# EAGLE design CellarControl (EAGLE 7.2.0)
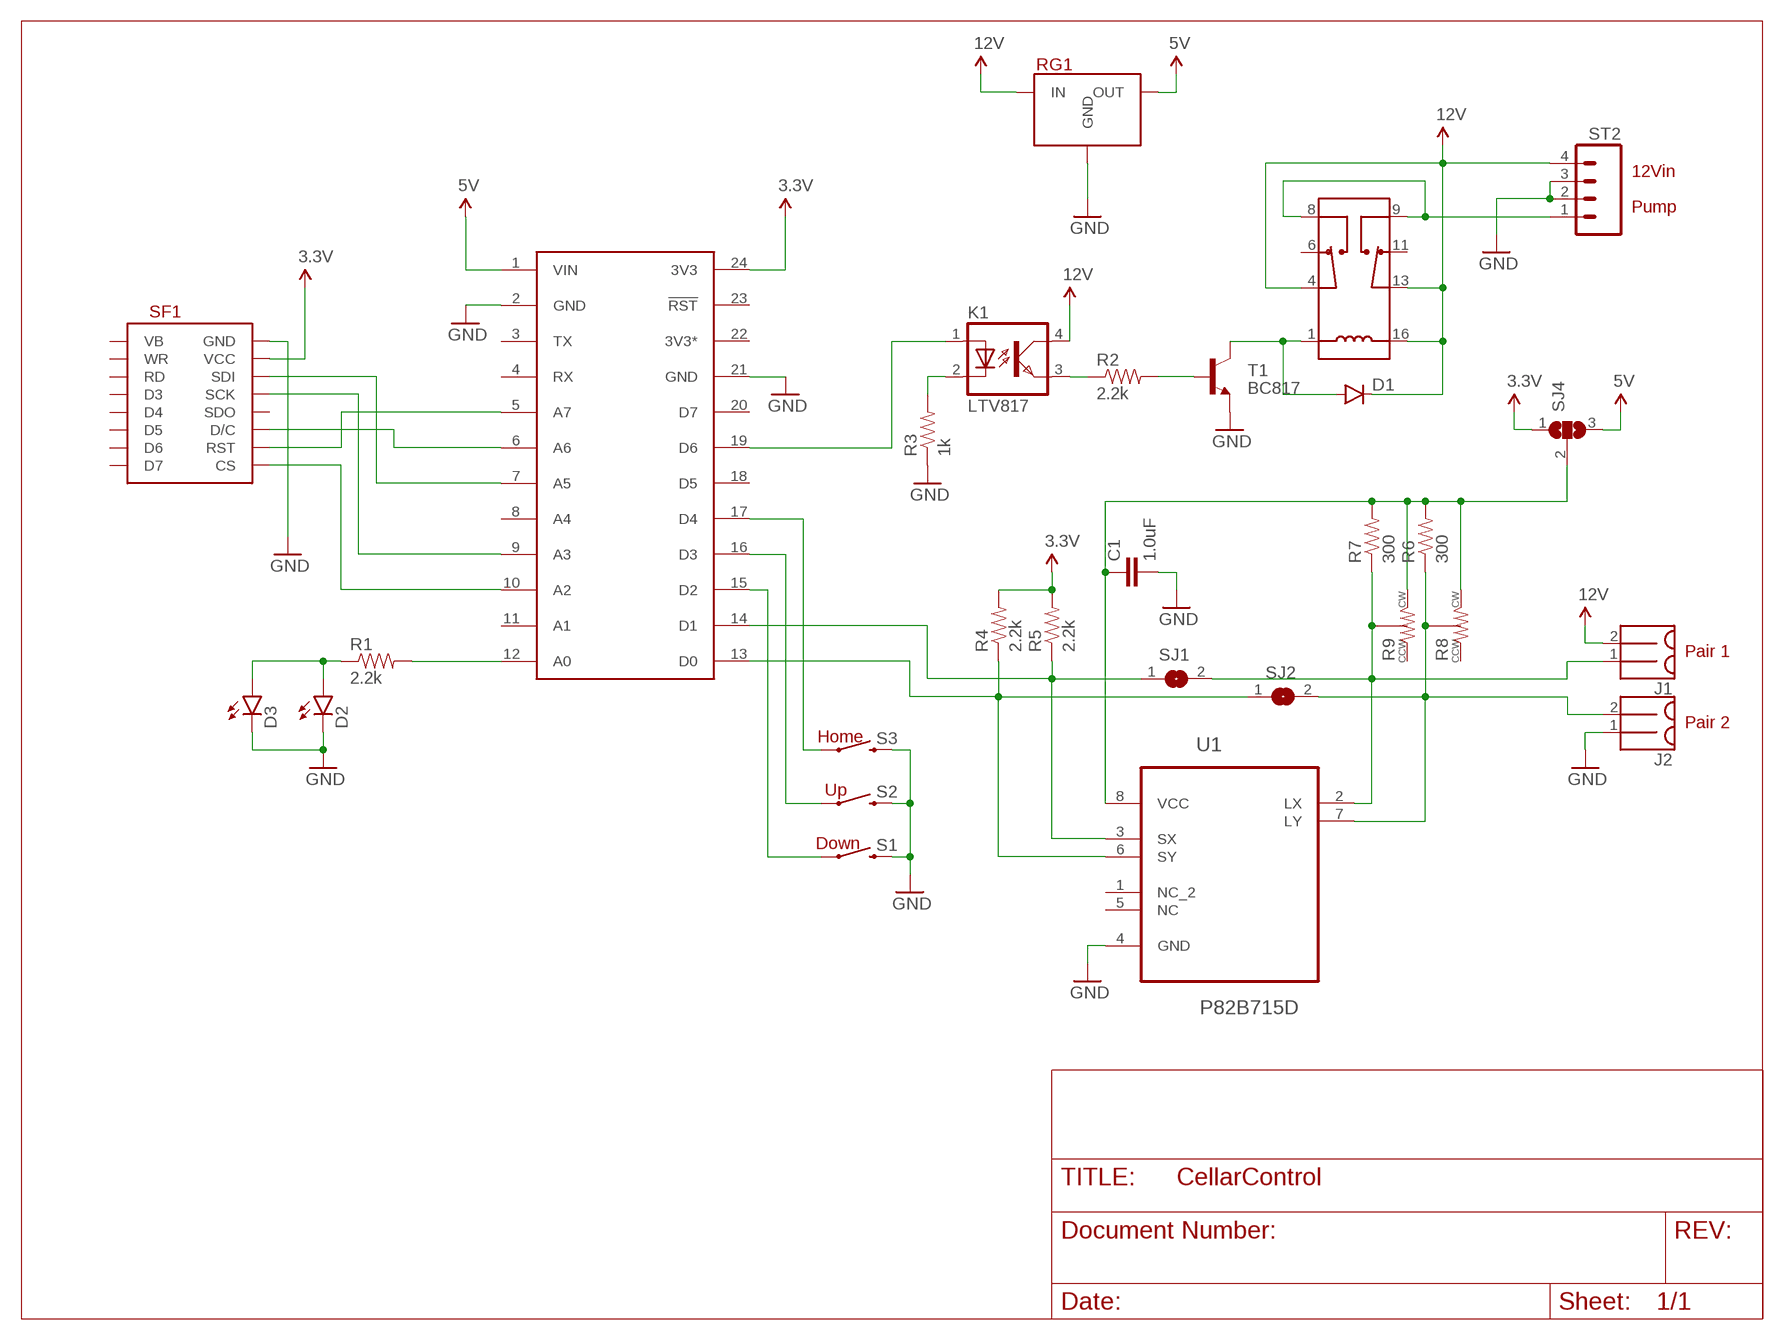
[diagram p0: schematic, sheet 1]

## Parts
C1  1.0uF  1.0UF-16V-10%(0603)  [0603-CAP]
D1  DIODEKIT  [DIODE-1N4148-KIT]
D2  LED3MM  [LED3MM]
D3  LED0603  [LED-0603]
J1  MOLEX_MINILITE_TRAP_2  [MOLEX_MINILITE_TRAP_2]
J2  MOLEX_MINILITE_TRAP_2  [MOLEX_MINILITE_TRAP_2]
K1  LTV817  [DIP4]
R1  2.2k  RESISTOR0805-RES  [0805]
R2  2.2k  RESISTOR0805-RES  [0805]
R3  1k  RESISTOR0805-RES  [0805]
R4  2.2k  RESISTOR0805-RES  [0805]
R5  2.2k  RESISTOR0805-RES  [0805]
R6  300  RESISTOR0805-RES  [0805]
R7  300  RESISTOR0805-RES  [0805]
R8  POT_3MM  [POT_3MM]
R9  POT_3MM  [POT_3MM]
RG1  MURATA_REG  [MURATA_REG_HOR]
RLY1  HK19F_5V_DPDT_RELAY  [DIP16-RELAY]
S1  SWITCH_MOMENT  [SWITCH_MOMENT_6MM]
S2  SWITCH_MOMENT  [SWITCH_MOMENT_6MM]
S3  SWITCH_MOMENT  [SWITCH_MOMENT_6MM]
SC1  SPARK_CORECORE  [SPARK_CORE]
SF1  SPARKFUN_OLED  [SPARKFUN_OLED]
SJ1  SJ  [SJ]
SJ2  SJ  [SJ]
SJ4  SJ2W  [SJ_2]
ST2  SCREWTERM_4  [SCREWTERM_0.2X4]
T1  BC817  [SOT-23]
U1  P82B715D  [SOIC127P600X175-8N]

## Nets
3.3V: R4.2 R5.2 SC1.24(3V3) SF1.VDD(VCC) SJ4.1
5V: RG1.3(OUT) SC1.1(VIN) SJ4.3
12V: D1.C J1.2 K1.4(COL) RG1.1(IN) RLY1.4(C1) RLY1.13(C2) RLY1.16(L2) ST2.4
GND: C1.2 D2.K(C) D3.C J2.1 R3.1 RG1.2(GND) S1.3 S1.4 S2.3 S2.4 S3.3 S3.4 SC1.2(GND) SC1.21(GND) SF1.GND ST2.2 ST2.3 T1.2(E) U1.4(GND)
LCL: J1.1 R7.1 R9.2 SJ1.2 U1.2(LX)
LDA: J2.2 R6.1 R8.2 SJ2.2 U1.7(LY)
N$1: RLY1.8(NO1) RLY1.9(NO2) ST2.1
N$2: D2.A D3.A R1.1
N$3: R1.2 SC1.12(A0)
N$4: SC1.7(A5) SF1.SDI
N$5: SC1.9(A3) SF1.SCK
N$6: SC1.10(A2) SF1.CS
N$7: SC1.6(A6) SF1.D/C
N$8: SC1.5(A7) SF1.RST
N$9: S1.1 S1.2 SC1.15(D2)
N$10: S2.1 S2.2 SC1.16(D3)
N$11: S3.1 S3.2 SC1.17(D4)
N$12: D1.A RLY1.1(L1) T1.3(C)
N$13: K1.2(C) R3.2
N$14: K1.1(A) SC1.19(D6)
N$15: K1.3(EMIT) R2.1
N$16: R2.2 T1.1(B)
SCL: R5.1 SC1.14(D1) SJ1.1 U1.3(SX)
SDA: R4.1 SC1.13(D0) SJ2.1 U1.6(SY)
VSEL: C1.1 R6.2 R7.2 R8.3 R9.3 SJ4.2 U1.8(VCC)
Unconnected: R8.1 R9.1 RLY1.6(NC1) RLY1.11(NC2) SC1.3(TX) SC1.4(RX) SC1.8(A4) SC1.11(A1) SC1.18(D5) SC1.20(D7) SC1.23(!RST) SF1.D3 SF1.D4 SF1.D5 SF1.D6 SF1.D7 SF1.RD SF1.SDO SF1.VB SF1.WR U1.1(NC_2) U1.5(NC)

## Notes on the sheet
- 12Vin
- Pump
- Pair 1
- Pair 2
- Home
- Up
- Down

## Power pins joined to a net without a drawn wire
3V3*: SC1.22(3V3*)

## Library data of the parts
C1 = SparkFun-Capacitors:1.0UF-16V-10%(0603): CAP-00868; PROD_ID: CAP-00868
D1 = SparkFun-DiscreteSemi:DIODE: Diode These are standard reverse protection diodes and small signal diodes. SMA package can handle up to about 1A. SOD-323 can handle about 200mA. What the SOD-323 package when ordering, there are some mfgs out there that are 5-pin packages.
D2 = SparkFun-LED:LED: LEDs Standard schematic elements and footprints for 5mm, 3mm, 1206, and 0603 sized LEDs. 5mm - Spark Fun Electronics SKU : COM-00529 (and others); PROD_ID: DIO-08794
D3 = SparkFun-LED:LED: LEDs Standard schematic elements and footprints for 5mm, 3mm, 1206, and 0603 sized LEDs. 5mm - Spark Fun Electronics SKU : COM-00529 (and others)
J1 J2 = Puffin:MOLEX_MINILITE_TRAP_2
K1 = Puffin:LTV817
R1-R7 = SparkFun-Resistors:RESISTOR: Resistor Basic schematic elements and footprints for 0603, 1206, and PTH resistors.
R8 R9 = Puffin:POT_3MM
RG1 = Puffin:MURATA_REG
RLY1 = Puffin:HK19F_5V_DPDT_RELAY: Subminiture DPDT DIP relay
S1-S3 = Puffin:SWITCH_MOMENT
SC1 = Spark:SPARK_CORE
SF1 = Puffin:SPARKFUN_OLED
SJ1 SJ2 = jumper:SJ: SMD solder JUMPER
SJ4 = jumper:SJ2W: SMD solder JUMPER
ST2 = Puffin:SCREWTERM_4
T1 = Puffin:BC817
U1 = Texas Instruments_By_element14_Batch_1:P82B715D: I2C BUS EXTENDER; MPN: P82B715D; OC_FARNELL: 1604945; OC_NEWARK: 84M9793; PACKAGE: SOIC-8; SUPPLIER: Texas Instruments

## Net classes
0 default: clearance 0.205 mm

## Board
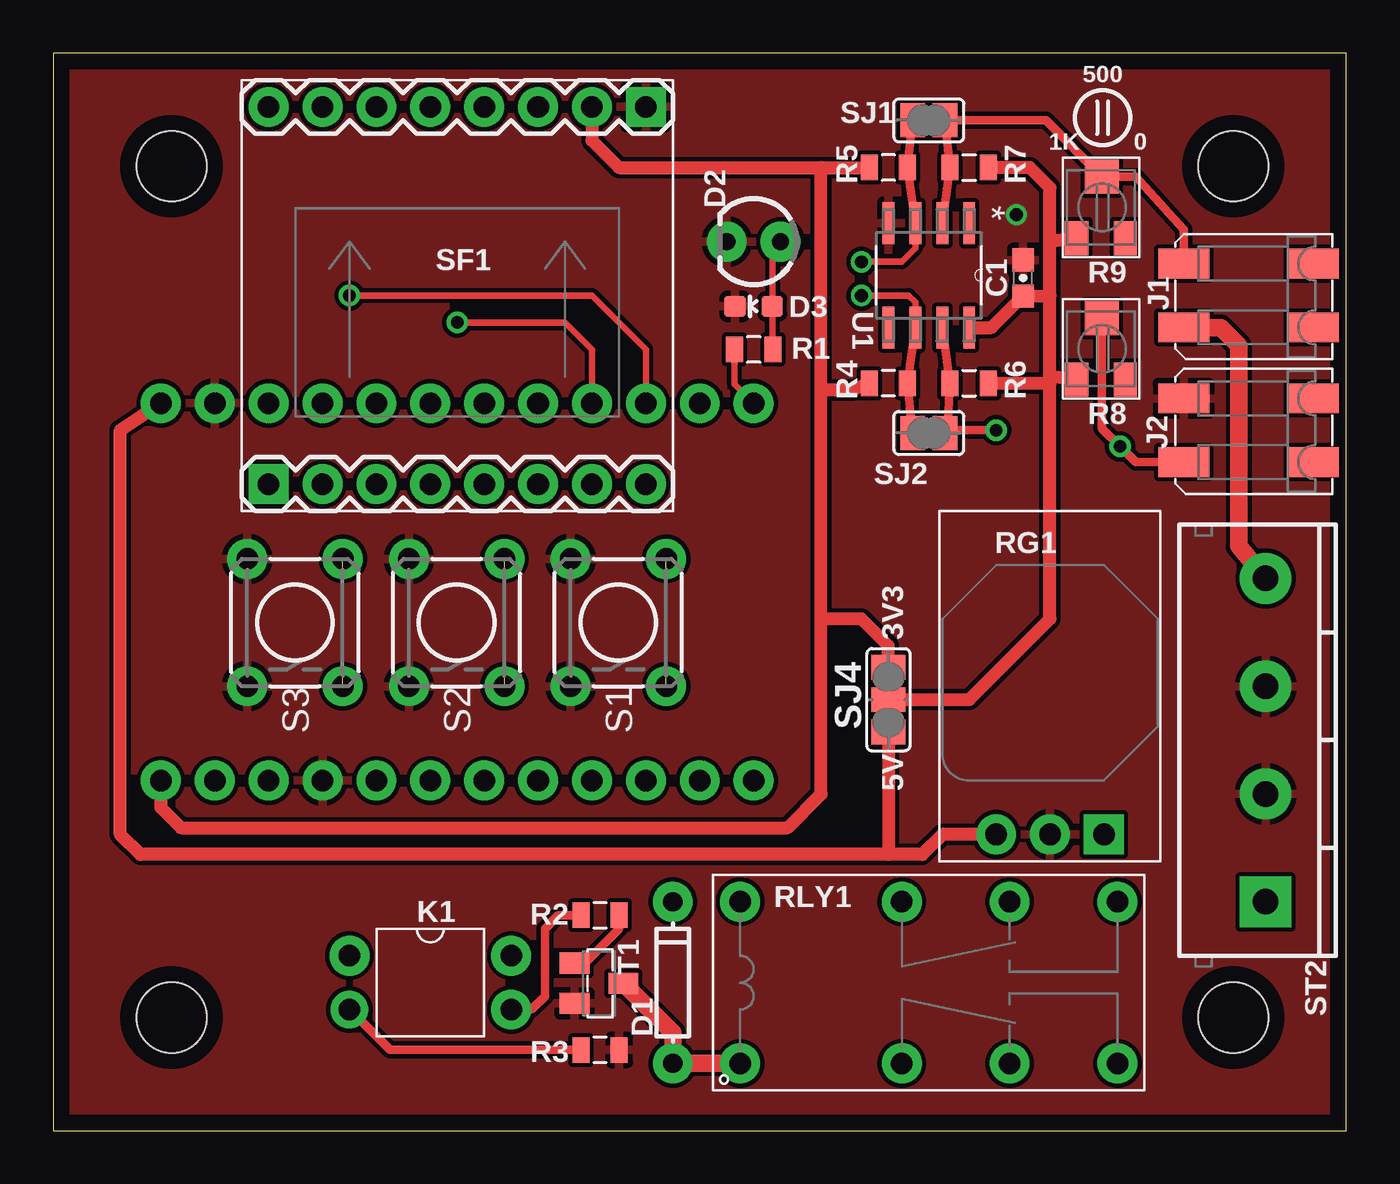
[diagram p1: board, top side]
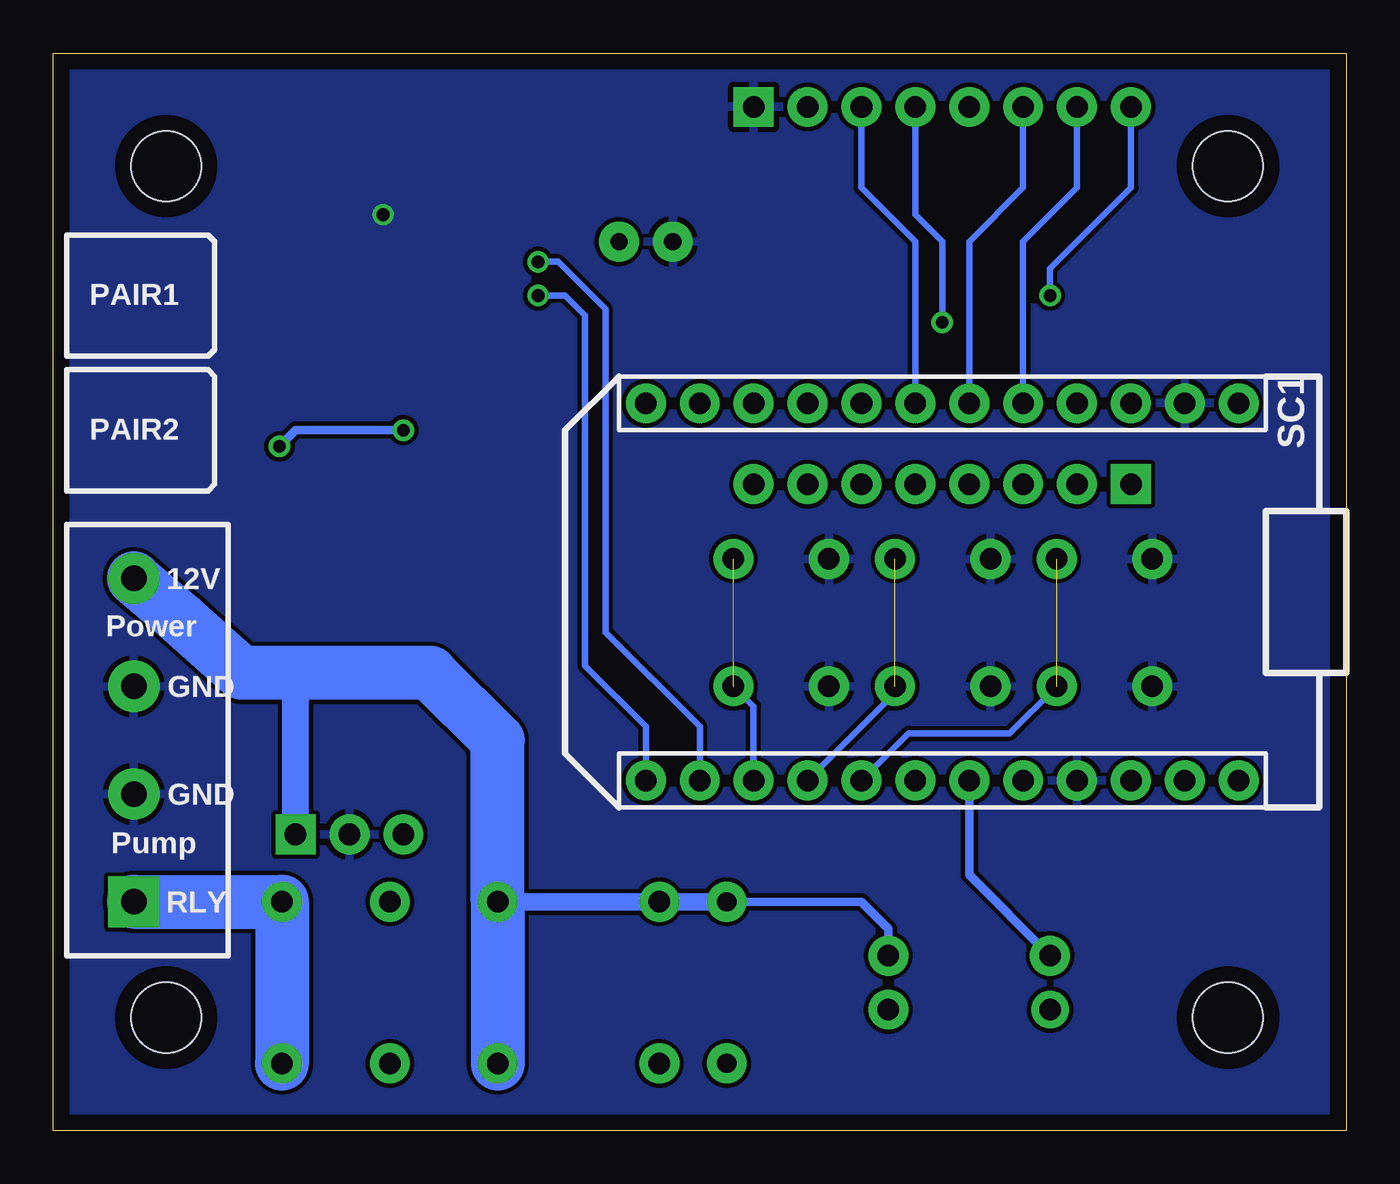
[diagram p2: board, bottom side, seen from below]

Size 60.96 x 50.8 mm. Coordinates in mm from the lower left corner, seen from the top.
Outline: 0,0 60.96,0 60.96,50.8 0,50.8 0,0
Copper layers (1*16): Top 0.035mm / dielectric 1.5mm / Bottom 0.035mm
Design rules "CellarControl": minimum track width 10mil, minimum drill 24mil, track to track 0.205mm, track to pad 0.205mm, pad to pad 0.205mm, via to via 0.205mm, smd to smd 8mil, copper to edge 30mil, drill to drill 8mil, minimum pad ring 10mil, minimum via ring 8mil, stop-mask expansion 4mil, vias tented up to drill 0mil, thermal gap 10mil

### Footprints (pad centres in the part's own frame; a part is rotated, then mirrored left to right if it is on the bottom)
0603-CAP = smd 1.1 x 1: 1 -0.85,0; 2 0.85,0
DIODE-1N4148-KIT = drill 0.9 pad 1.88: A -3.81,0; C 3.81,0
LED3MM = drill 0.813 pad 1.88: A -1.27,0; K 1.27,0
LED-0603 = smd 1 x 1: A 0,-0.877; C 0,0.877
MOLEX_MINILITE_TRAP_2 = smd 2.4 x 1.4: 1 -3.1,1.5; 2 -3.1,-1.5; 3 3,1.5; 4 3,-1.5
DIP4 = drill 1.016 pad 1.88: 1 -1.27,-3.81; 3 1.27,3.81; 4 -1.27,3.81 | drill 1.016 pad 1.778: 2 1.27,-3.81
0805 = smd 0.8 x 1.2: 1 -0.9,0; 2 0.9,0
POT_3MM = smd 1.1 x 1.6: 1 2.85,0.8; 3 0.55,0.8 | smd 1.6 x 1.6: 2 1.75,3.7
MURATA_REG_HOR = drill 1.016 pad 1.88 square: 1 2.54,0 | drill 1.016 pad 1.88: 2 0,0; 3 -2.54,0
DIP16-RELAY = drill 1.016 pad 1.88: 1 -8.89,-3.81; 4 -1.27,-3.81; 6 3.81,-3.81; 8 8.89,-3.81; 9 8.89,3.81; 11 3.81,3.81; 13 -1.27,3.81; 16 -8.89,3.81
SWITCH_MOMENT_6MM = drill 1.016 pad 1.88: 1 0,0; 2 6,0; 3 6,4.5; 4 0,4.5
SPARK_CORE = drill 1.016 pad 1.88: 1 -8.89,13.97; 2 -8.89,11.43; 3 -8.89,8.89; 4 -8.89,6.35; 5 -8.89,3.81; 6 -8.89,1.27; 7 -8.89,-1.27; 8 -8.89,-3.81; 9 -8.89,-6.35; 10 -8.89,-8.89; 11 -8.89,-11.43; 12 -8.89,-13.97; 13 8.89,-13.97; 14 8.89,-11.43; 15 8.89,-8.89; 16 8.89,-6.35; 17 8.89,-3.81; 18 8.89,-1.27; 19 8.89,1.27; 20 8.89,3.81; 21 8.89,6.35; 22 8.89,8.89; 23 8.89,11.43; 24 8.89,13.97
SPARKFUN_OLED = drill 1.016 pad 1.88: CS 1.27,19.05; D3 8.89,1.27; D4 11.43,1.27; D5 13.97,1.27; D6 16.51,1.27; D7 19.05,1.27; D/C 6.35,19.05; RD 6.35,1.27; RST 3.81,19.05; SCK 11.43,19.05; SDI 13.97,19.05; SDO 8.89,19.05; VDD 16.51,19.05; WR 3.81,1.27 | drill 1.016 pad 1.88 square: GND 19.05,19.05; VB 1.27,1.27
SJ = smd 1.168 x 1.6: 1 -0.762,0; 2 0.762,0
SJ_2 = smd 1.168 x 1.6: 1 -1.524,0; 2 0,0; 3 1.524,0
SCREWTERM_0.2X4 = drill 1.2 pad 2.413 square: 1 0,0 | drill 1.2 pad 2.413: 2 5.08,0; 3 10.16,0; 4 15.24,0
SOT-23 = smd 1 x 1.4: 1 -0.92,-1.2; 2 0.98,-1.2; 3 0.03,1.1
SOIC127P600X175-8N = smd 1.981 x 0.559: 1 -2.464,1.905; 2 -2.464,0.635; 3 -2.464,-0.635; 4 -2.464,-1.905; 5 2.464,-1.905; 6 2.464,-0.635; 7 2.464,0.635; 8 2.464,1.905
STAND-OFF = hole 3.302: 0,0

### Placement (x,y rotation side)
C1  45.72,40.2 90 top
D1  29.21,6.99 90 top
D2  33.02,41.91 180 top
D3  33.02,38.86 90 top
J1  56.39,39.37 0 top
J2  56.39,33.02 0 top
K1  17.78,6.99 270 top
R1  33.02,36.83 180 top
R2  25.78,10.16 0 top
R3  25.78,3.81 180 top
R4  39.37,35.24 180 top
R5  39.37,45.4 180 top
R6  43.18,35.24 0 top
R7  43.18,45.4 0 top
R8  47.69,34.61 0 top
R9  47.69,41.27 0 top
RG1  46.99,13.97 0 top
RLY1  41.27,6.99 0 top
S1  28.89,20.95 90 top
S2  21.27,20.95 90 top
S3  13.65,20.95 90 top
SC1  19.05,25.4 270 bottom
SF1  8.89,29.21 0 top
SJ1  41.27,47.62 0 top
SJ2  41.27,32.89 0 top
SJ4  39.37,20.32 270 top
ST2  57.15,10.79 90 top
T1  25.78,6.99 270 top
U1  41.27,40.32 270 top
U$2  [STAND-OFF]  5.59,5.33 0 top
U$4  [STAND-OFF]  55.63,5.33 0 top
U$5  [STAND-OFF]  55.63,45.47 0 top
U$6  [STAND-OFF]  5.59,45.47 0 top

### Tracks (layer width: path | path; a pad name or v marks a point on that pad's centre or on a via)
3.3V
  Top 0.61: SF1.VDD 25.4,46.67 26.67,45.4 36.2,45.4 | 36.2,45.4 R5.2 | 36.2,24.13 36.2,15.88 34.61,14.29 6.03,14.29 5.08,15.24 SC1.24 | 36.2,24.13 36.2,34.92 | 36.2,34.92 36.2,45.4 | R4.2 37.71,34.92 36.2,34.92 | SJ4.1 39.37,22.86 38.1,24.13 36.2,24.13
5V
  Top 0.61: 39.37,13.02 4.13,13.02 3.17,13.97 3.17,33.02 SC1.1 | SJ4.3 39.37,13.02 | RG1.3 41.91,13.97 40.96,13.02 39.37,13.02
12V
  Top 0.813: J1.2 55.03,37.87 55.88,37.02 55.88,27.56 ST2.4
  Bottom 0.406: D1.C 22.86,10.79 21.59,9.53 K1.4
  Bottom 0.813: RLY1.13 RLY1.16 D1.C
  Bottom 1.27: RG1.1 49.53,21.59
  Bottom 2.54: ST2.4 54.93,24.13 52.07,21.59 49.53,21.59 43.18,21.59 40.01,18.41 RLY1.13 RLY1.4
GND  (via drill 0.6)
  other vias: 45.4,43.18
  pour Top: -1.27,52.07 62.23,52.07 62.23,-1.27 -1.27,-1.27
  pour Bottom: -1.27,52.07 62.23,52.07 62.23,-1.27 -1.27,-1.27
LCL
  Top 0.305: R9.2 49.53,45.07
  Top 0.406: U1.2 R7.1 SJ1.2 46.79,47.62 R9.2 51.04,44.98 53.29,42.47 J1.1
LDA  (via drill 0.6)
  Top 0.406: SJ2.2 42.16,33.02 | 42.16,33.02 v44.45,33.02 | J2.2 51.03,31.52 v50.29,32.26 49.44,33.11 R8.2 | U1.7 R6.1 42.16,33.02
  Bottom 0.406: v44.45,33.02 49.53,33.02 v50.29,32.26
N$1
  Bottom 2.54: ST2.1 RLY1.9 RLY1.8
N$2
  Top 0.305: R1.1 33.9,36.85 D3.A 33.9,41.52 D2.A
N$3
  Top 0.305: SC1.12 32.12,35.19 R1.2
N$4
  Bottom 0.305: SC1.7 20.32,41.91 22.86,44.45 SF1.SDI
N$5  (via drill 0.6)
  Top 0.305: v19.05,38.1 24.13,38.1 25.4,36.83 SC1.9
  Bottom 0.305: SF1.SCK 20.32,43.18 19.05,41.91 v19.05,38.1
N$6  (via drill 0.6)
  Top 0.305: SC1.10 27.94,36.83 25.4,39.37 v13.97,39.37
  Bottom 0.305: v13.97,39.37 13.97,40.64 10.16,44.45 SF1.CS
N$7
  Bottom 0.305: SC1.6 17.78,41.91 15.24,44.45 SF1.D/C
N$8
  Bottom 0.305: SF1.RST 12.7,44.45 15.24,41.91 SC1.5
N$9  (1 unrouted)
  Bottom 0.305: SC1.15 27.94,20 S1.1
N$10  (1 unrouted)
  Bottom 0.305: SC1.16 21.27,20.64 S2.1
N$11  (1 unrouted)
  Bottom 0.305: SC1.17 20.64,18.73 15.88,18.73 S3.1
N$12
  Top 0.813: RLY1.1 D1.A 29.21,4.63 T1.3
N$13
  Top 0.406: R3.2 15.88,3.81 K1.2
N$14
  Bottom 0.406: SC1.19 17.78,12.06 K1.1
N$15
  Top 0.406: K1.3 22.54,5.71 23.18,6.35 23.18,9.53 23.81,10.16 R2.1
N$16
  Top 0.406: T1.1 25.05,7.91 26.67,9.53 26.67,10.15 R2.2
SCL  (via drill 0.6)
  Top 0.305: U1.3 40.64,41.59 40.01,40.96 v38.1,40.96
  Top 0.406: U1.3 R5.1 SJ1.1
  Bottom 0.305: SC1.14 30.48,19.05 34.92,23.5 34.92,38.73 37.15,40.96 v38.1,40.96
SDA  (via drill 0.6)
  Top 0.305: v38.1,39.37 40.32,39.37 40.64,39.05 U1.6
  Top 0.406: U1.6 R4.1 SJ2.1
  Bottom 0.305: SC1.13 33.02,19.05 35.88,21.91 35.88,38.42 36.83,39.37 v38.1,39.37
VSEL
  Top 0.61: SJ4.2 43.18,20.32 46.99,24.13 46.99,35.24 | 46.99,35.24 46.99,35.56 | 46.99,35.56 46.99,39.37 | 46.99,39.37 46.99,41.91 | 46.99,41.91 46.99,44.45 46.04,45.4 R7.2 | R9.3 46.99,41.91 | 46.99,39.37 C1.1 44.23,37.86 U1.8 | R8.3 46.99,35.56 | R6.2 46.99,35.24

### Text on the board
tPlace: 500 | 1K | 0 | 3V3 | 5V
bPlace: PAIR1 | PAIR2 | 12V | Power | GND | GND | Pump | RLY